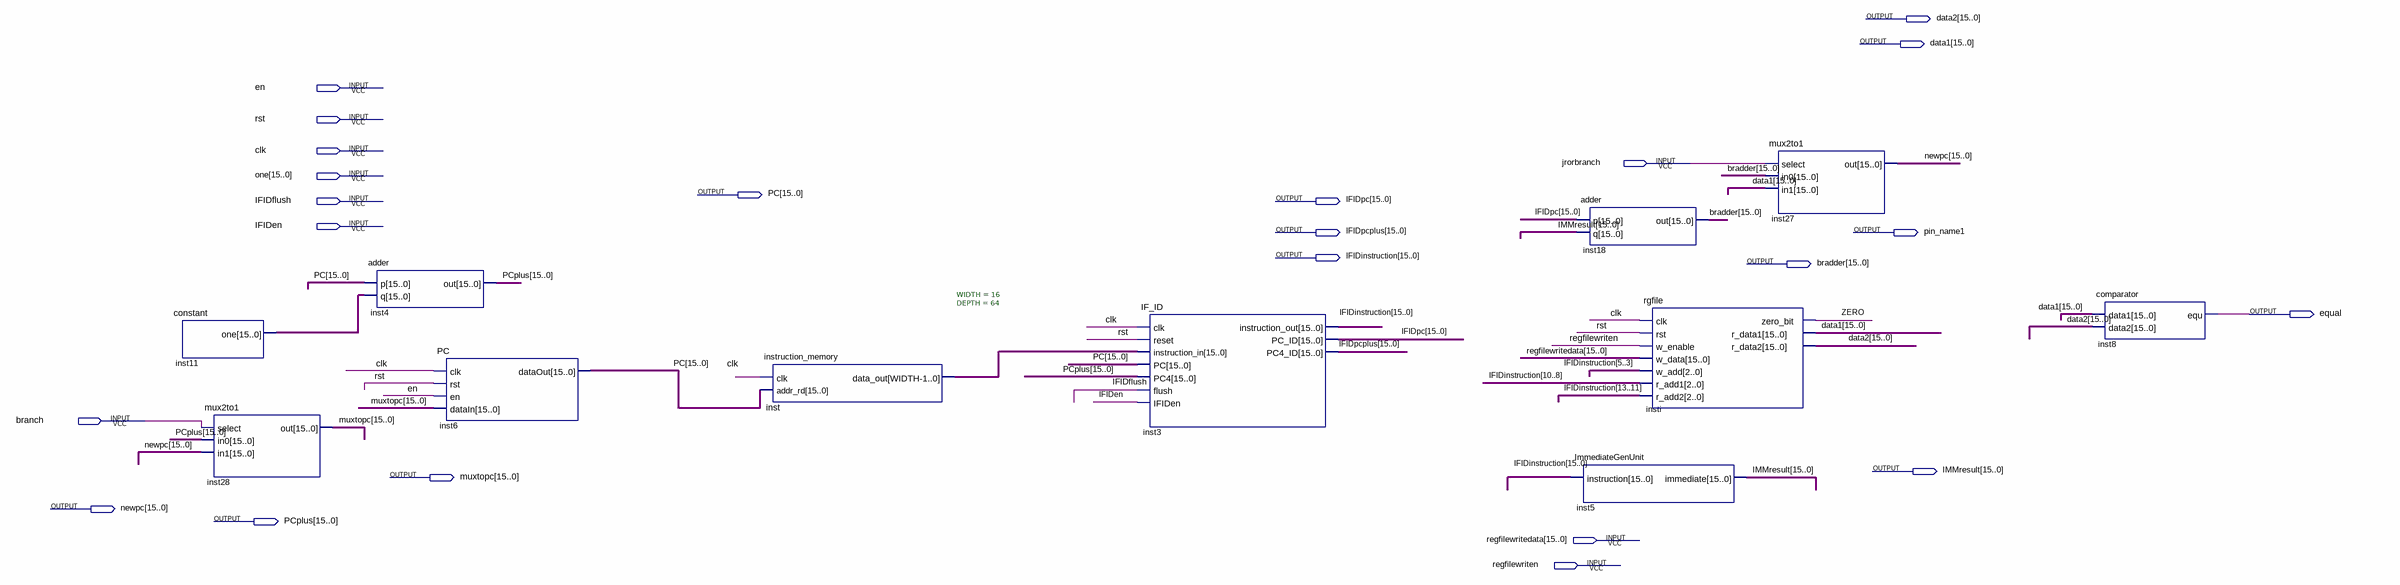
[diagram p0: schematic sheet]
// Quartus schematic IFIDblocktest.bdf as structural Verilog: 11 symbols, 23 pins
module IFIDblocktest (
  input  en,
  input  rst,
  input  clk,
  input  jrorbranch,
  input  [15:0] one,
  input  IFIDflush,
  input  IFIDen,
  input  branch,
  input  [15:0] regfilewritedata,
  input  regfilewriten,
  output [15:0] data2,
  output [15:0] data1,
  output [15:0] PC,
  output [15:0] IFIDpc,
  output [15:0] IFIDpcplus,
  output pin_name1,
  output [15:0] IFIDinstruction,
  output [15:0] bradder,
  output equal,
  output [15:0] IMMresult,
  output [15:0] muxtopc,
  output [15:0] newpc,
  output [15:0] PCplus
);

  wire ZERO;
  wire [15:0] inst11_one, inst_data_out;

  constant inst11 (.one(inst11_one));
  mux2to1 inst28 (.select(branch), .in0(PCplus), .in1(newpc), .out(muxtopc));
  adder inst4 (.p(PC), .q(inst11_one), .out(PCplus));
  PC inst6 (.clk(clk), .rst(rst), .en(en), .dataIn(muxtopc), .dataOut(PC));
  instruction_memory #(.WIDTH(16), .DEPTH(64)) inst (.clk(clk), .addr_rd(PC), .data_out(inst_data_out));
  IF_ID inst3 (
    .clk(clk), .reset(rst), .instruction_in(inst_data_out), .PC(PC), .PC4(PCplus), .flush(IFIDflush),
    .IFIDen(IFIDen), .instruction_out(IFIDinstruction), .PC_ID(IFIDpc), .PC4_ID(IFIDpcplus));
  adder inst18 (.p(IFIDpc), .q(IMMresult), .out(bradder));
  ImmediateGenUnit inst5 (.instruction(IFIDinstruction), .immediate(IMMresult));
  rgfile insti (
    .clk(clk), .rst(rst), .w_enable(regfilewriten), .w_data(regfilewritedata), .w_add(IFIDinstruction[5:3]),
    .r_add1(IFIDinstruction[10:8]), .r_add2(IFIDinstruction[13:11]), .zero_bit(ZERO), .r_data1(data1),
    .r_data2(data2));
  mux2to1 inst27 (.select(jrorbranch), .in0(bradder), .in1(data1), .out(newpc));
  comparator inst8 (.data1(data1), .data2(data2), .equ(equal));
endmodule
